# Altium schematic sheet Relay Module Schematic.SchDoc
size A4
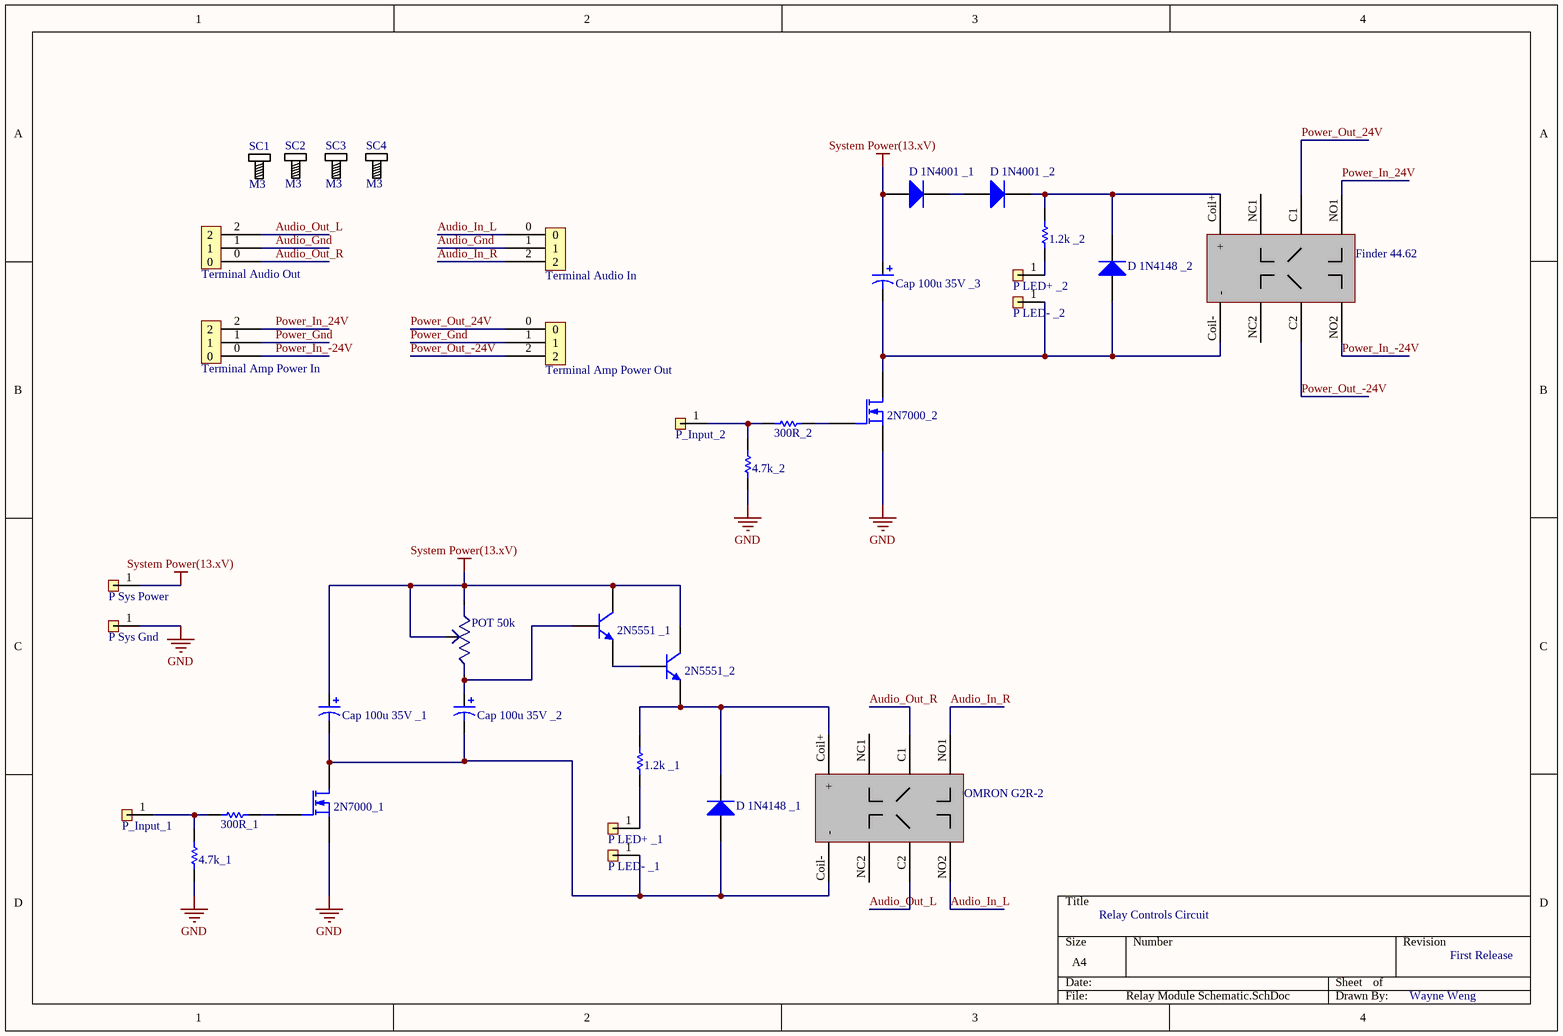
[diagram p0: Relay Module Schematic.SchDoc]

## Parts
1.2k__1  Resistor SMD 0805  [RES_0805]  (value not drawn)
1.2k__2  Resistor SMD 0805  [RES_0805]  (value not drawn)
2N5551_2  2N5551  [2N5551]  (value not drawn)
2N5551__1  2N5551  [2N5551]  (value not drawn)
2N7000_1  2N7000  [2N7000]  (value not drawn)
2N7000_2  2N7000  [2N7000]  (value not drawn)
4.7k_1  Resistor SMD 0805  [RES_0805]  (value not drawn)
4.7k_2  Resistor SMD 0805  [RES_0805]  (value not drawn)
300R_1  Resistor SMD 0805  [RES_0805]  (value not drawn)
300R_2  Resistor SMD 0805  [RES_0805]  (value not drawn)
Cap_100u_35V__1  Cap  [Radial Capacitor 3.5mm Pitch]  (value not drawn)
Cap_100u_35V__2  Cap  [Radial Capacitor 3.5mm Pitch]  (value not drawn)
Cap_100u_35V__3  Cap  [Radial Capacitor 3.5mm Pitch]  (value not drawn)
D_1N4001__1  Diode 1N4001  [DO-41]  (value not drawn)
D_1N4001__2  Diode 1N4001  [DO-41]  (value not drawn)
D_1N4148__1  Diode 1N4148  [DO-35]  (value not drawn)
D_1N4148__2  Diode 1N4148  [DO-35]  (value not drawn)
Finder_44.62  Finder 44.62  [Finder 44.62]  (value not drawn)
OMRON_G2R-2  OMRON G2R-2  [OMRON G2R-2 - Brown]  (value not drawn)
P_Input_1  Header 1 Pin  [HDR1X1_180_2.54]  (value not drawn)
P_Input_2  Header 1 Pin  [HDR1X1_180_2.54]  (value not drawn)
P_LED+__1  Header 1 Pin  [HDR1X1_180_2.54]  (value not drawn)
P_LED+__2  Header 1 Pin  [HDR1X1_180_2.54]  (value not drawn)
P_LED-__1  Header 1 Pin  [HDR1X1_180_2.54]  (value not drawn)
P_LED-__2  Header 1 Pin  [HDR1X1_180_2.54]  (value not drawn)
P_Sys_Gnd  Header 1 Pin  [HDR1X1_180_2.54]  (value not drawn)
P_Sys_Power  Header 1 Pin  [HDR1X1_180_2.54]  (value not drawn)
POT_50k  BOURNS 3296  [Potentiometer 25 Turn]  (value not drawn)
SC1  M3  [SCRREW_M3]
SC2  M3  [SCRREW_M3]
SC3  M3  [SCRREW_M3]
SC4  M3  [SCRREW_M3]
Terminal_Amp_Power_In  3P Terminal Block  [3P Terminal Block]  (value not drawn)
Terminal_Amp_Power_Out  3P Terminal Block  [3P Terminal Block]  (value not drawn)
Terminal_Audio_In  3P Terminal Block  [3P Terminal Block]  (value not drawn)
Terminal_Audio_Out  3P Terminal Block  [3P Terminal Block]  (value not drawn)

## Nets
GND: 2N7000_1.1(S) 2N7000_2.1(S) 4.7k_1.1 4.7k_2.1 P_Sys_Gnd.1
System Power(13.xV): 2N5551_2.3(C) 2N5551__1.3(C) Cap_100u_35V__1.0 Cap_100u_35V__3.0 D_1N4001__1.1(A) P_Sys_Power.1 POT_50k.2 POT_50k.3
Audio_Gnd: Terminal_Audio_In.1 Terminal_Audio_Out.1
Audio_In_L: OMRON_G2R-2.NO2 Terminal_Audio_In.0
Audio_In_R: OMRON_G2R-2.NO1 Terminal_Audio_In.2
Audio_Out_L: OMRON_G2R-2.C2 Terminal_Audio_Out.2
Audio_Out_R: OMRON_G2R-2.C1(NC) Terminal_Audio_Out.0
Power_Gnd: Terminal_Amp_Power_In.1 Terminal_Amp_Power_Out.1
Power_In_24V: Finder_44.62.NO1 Terminal_Amp_Power_In.2
Power_In_-24V: Finder_44.62.NO2 Terminal_Amp_Power_In.0
Power_Out_24V: Finder_44.62.C1(NC) Terminal_Amp_Power_Out.0
Power_Out_-24V: Finder_44.62.C2 Terminal_Amp_Power_Out.2
Net1.2k__1_1: 1.2k__1.1 P_LED+__1.1
Net1.2k__1_2: 1.2k__1.2 2N5551_2.1(E) D_1N4148__1.2(K) OMRON_G2R-2.Coil+(+)
Net1.2k__2_1: 1.2k__2.1 P_LED+__2.1
Net1.2k__2_2: 1.2k__2.2 D_1N4001__2.2(K) D_1N4148__2.2(K) Finder_44.62.Coil+(+)
Net2N5551_2_2: 2N5551_2.2(B) 2N5551__1.1(E)
Net2N5551__1_2: 2N5551__1.2(B) Cap_100u_35V__2.0 POT_50k.1
Net2N7000_1_2: 2N7000_1.2(G) 300R_1.2
Net2N7000_1_3: 2N7000_1.3(D) Cap_100u_35V__1.1 Cap_100u_35V__2.1 D_1N4148__1.1(A) OMRON_G2R-2.Coil-(-) P_LED-__1.1
Net2N7000_2_2: 2N7000_2.2(G) 300R_2.2
Net2N7000_2_3: 2N7000_2.3(D) Cap_100u_35V__3.1 D_1N4148__2.1(A) Finder_44.62.Coil-(-) P_LED-__2.1
Net4.7k_1_2: 4.7k_1.2 300R_1.1 P_Input_1.1
Net4.7k_2_2: 4.7k_2.2 300R_2.1 P_Input_2.1
NetD_1N4001__1_2: D_1N4001__1.2(K) D_1N4001__2.1(A)

Not connected (* = marked no-connect by the designer): Finder_44.62 NC1(2) NC2; OMRON_G2R-2 NC1(2) NC2

## Notes on the sheet
- Relay Controls Circuit
- First Release
- Wayne Weng

## Library data of the parts
2N5551_2 2N5551__1 = 2N5551: NPN 2N5551 General Purpose Amplifier
2N7000_1 2N7000_2 = 2N7000: 2N7000 TO-92
Cap_100u_35V__1-Cap_100u_35V__3 = Cap Radial 8*11 3.5mm Pitch
D_1N4001__1 D_1N4001__2 = Diode 1N4001: 1 Amp General Purpose Rectifier; Published: 8-Jun-2000; LatestRevisionDate: 17-Jul-2002; LatestRevisionNote: Re-released for DXP Platform.; DatasheetVersion: 1998; PackageVersion: Aug-1999; PackageReference: DO-41; Publisher: Altium Limited; PackageDescription: Diode, Axial; Body 5.2 x 2.7 mm (LxDia. max), Lead Dia. 0.86 mm (max); Code_JEDEC: DO-204-AL; ComponentLink1Description: Manufacturer Link; ComponentLink1URL: http://www.fairchildsemi.com/; ComponentLink2Description: Datasheet; ComponentLink2URL: http://www.fairchildsemi.com/ds/1N%2F1N4001.pdf
D_1N4148__1 D_1N4148__2 = Diode 1N4148: High Conductance Fast Diode; Published: 8-Jun-2000; LatestRevisionDate: 17-Jul-2002; LatestRevisionNote: Re-released for DXP Platform.; DatasheetVersion: 1997; PackageReference: DO-35; Publisher: Altium Limited; PackageDescription: Diode, Axial; Body 3.8 x 1.9 mm (LxDia. max), Lead Dia. 0.53 mm (max); Code_JEDEC: DO-204-AH; ComponentLink1Description: Manufacturer Link; ComponentLink1URL: http://www.fairchildsemi.com/; ComponentLink2Description: Datasheet; ComponentLink2URL: http://www.fairchildsemi.com/ds/1N%2F1N4148.pdf
Finder_44.62 = Finder 44.62: Finder 44.62 PCB Relay
OMRON_G2R-2 = OMRON G2R-2: OMRON G2R-2 Power Relay DPDT
SC1-SC4 = Screw_M3: Screw
Terminal_Amp_Power_In Terminal_Amp_Power_Out Terminal_Audio_In Terminal_Audio_Out = 3P Terminal Block: Howder 3P Terminal Block HD-816-3P
1.2k__1 1.2k__2 4.7k_1 4.7k_2 300R_1 300R_2 = Resistor SMD 0805: Published: 8-Jun-2000; LatestRevisionDate: 17-Jul-2002; LatestRevisionNote: Re-released for DXP Platform.; PackageReference: AXIAL-0.3; Publisher: Altium Limited; PackageDescription: Axial Device, Thru-Hole; 2 Leads; 0.3 in Pin Spacing